# Altium project BMS48Voltsv0.1.PrjPcb
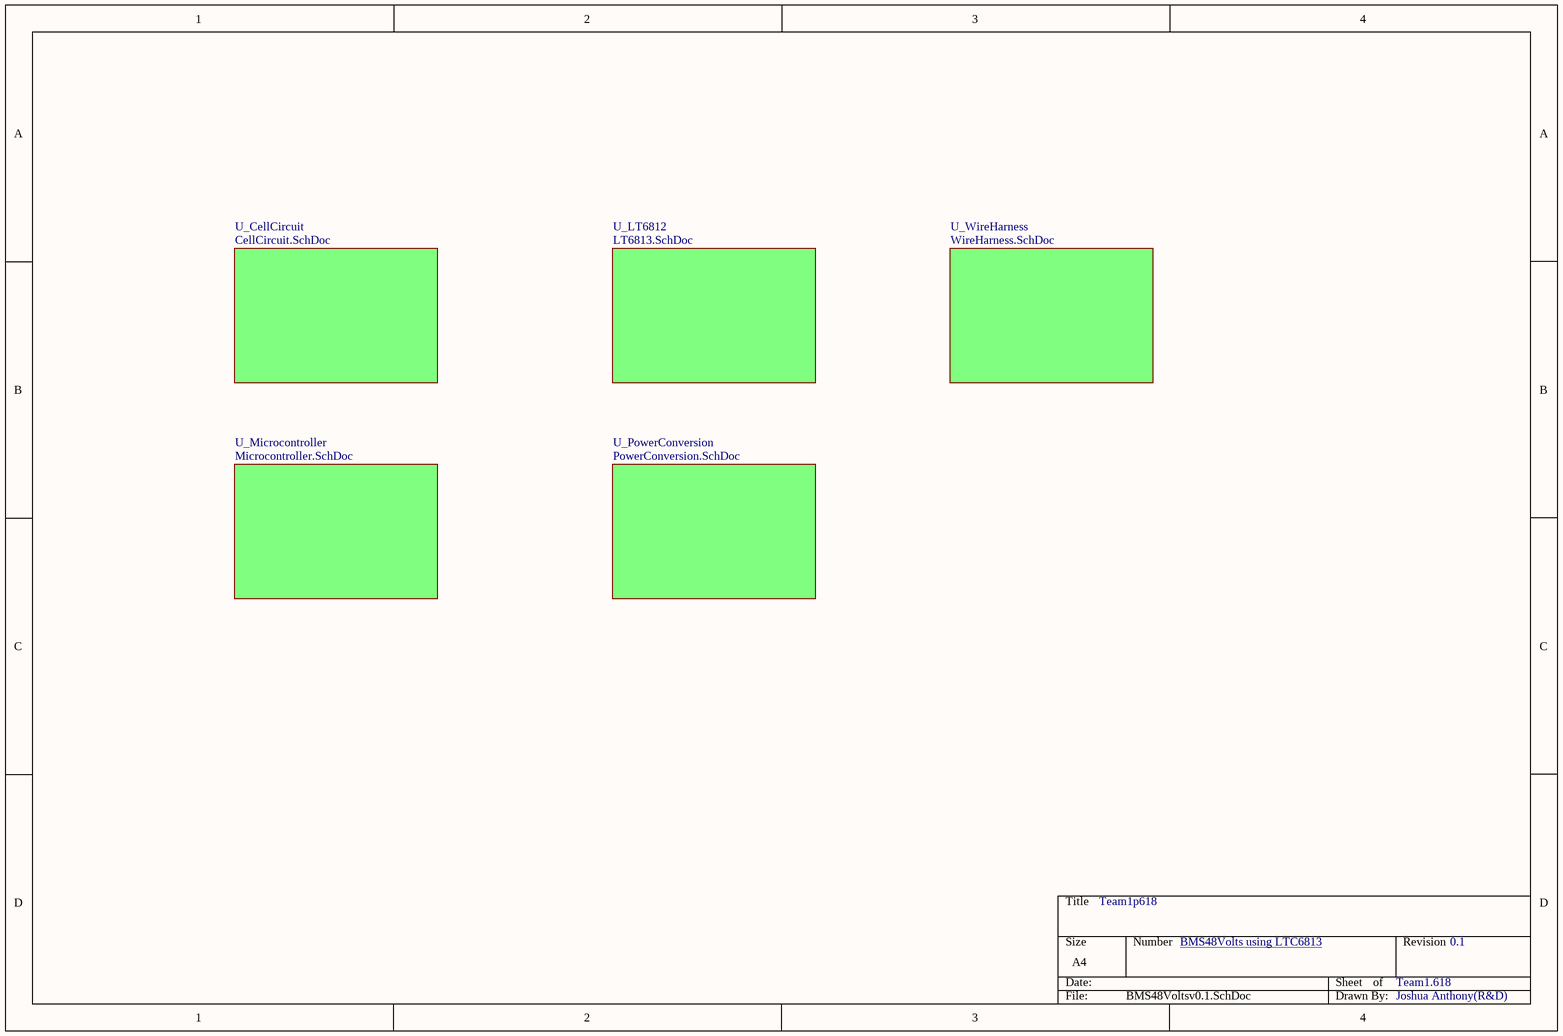
[diagram p0: BMS48Voltsv0.1.SchDoc]
5 sheets, 155 parts. Net scope: flat (ports and power ports of the same name join across sheets).
Board file: BMS48Voltsv0.1.PcbDoc
Sheets:
  BMS48Voltsv0.1.SchDoc
    U_CellCircuit = CellCircuit.SchDoc
    U_LT6812 = LT6813.SchDoc
    U_Microcontroller = Microcontroller.SchDoc
    U_PowerConversion = PowerConversion.SchDoc

## Sheet BMS48Voltsv0.1.SchDoc
size A4; SheetNumber: 1; SheetTotal: 6

### Sub-sheets
U_CellCircuit = CellCircuit.SchDoc: no entries
U_LT6812 = LT6813.SchDoc: no entries
U_Microcontroller = Microcontroller.SchDoc: no entries
U_PowerConversion = PowerConversion.SchDoc: no entries
U_WireHarness = WireHarness.SchDoc (file not in this document): no entries

### Notes on the sheet
- Team1p618
- BMS48Volts using LTC6813 <https://github.com/analogdevicesinc/Linduino/blob/master/LTSketchbook/libraries/LTC6813/LTC6813.cpp>
- Team1.618
- 0.1
- Joshua Anthony(R&D)

## Sheet CellCircuit.SchDoc
size A3; SheetNumber: 3; SheetTotal: 5
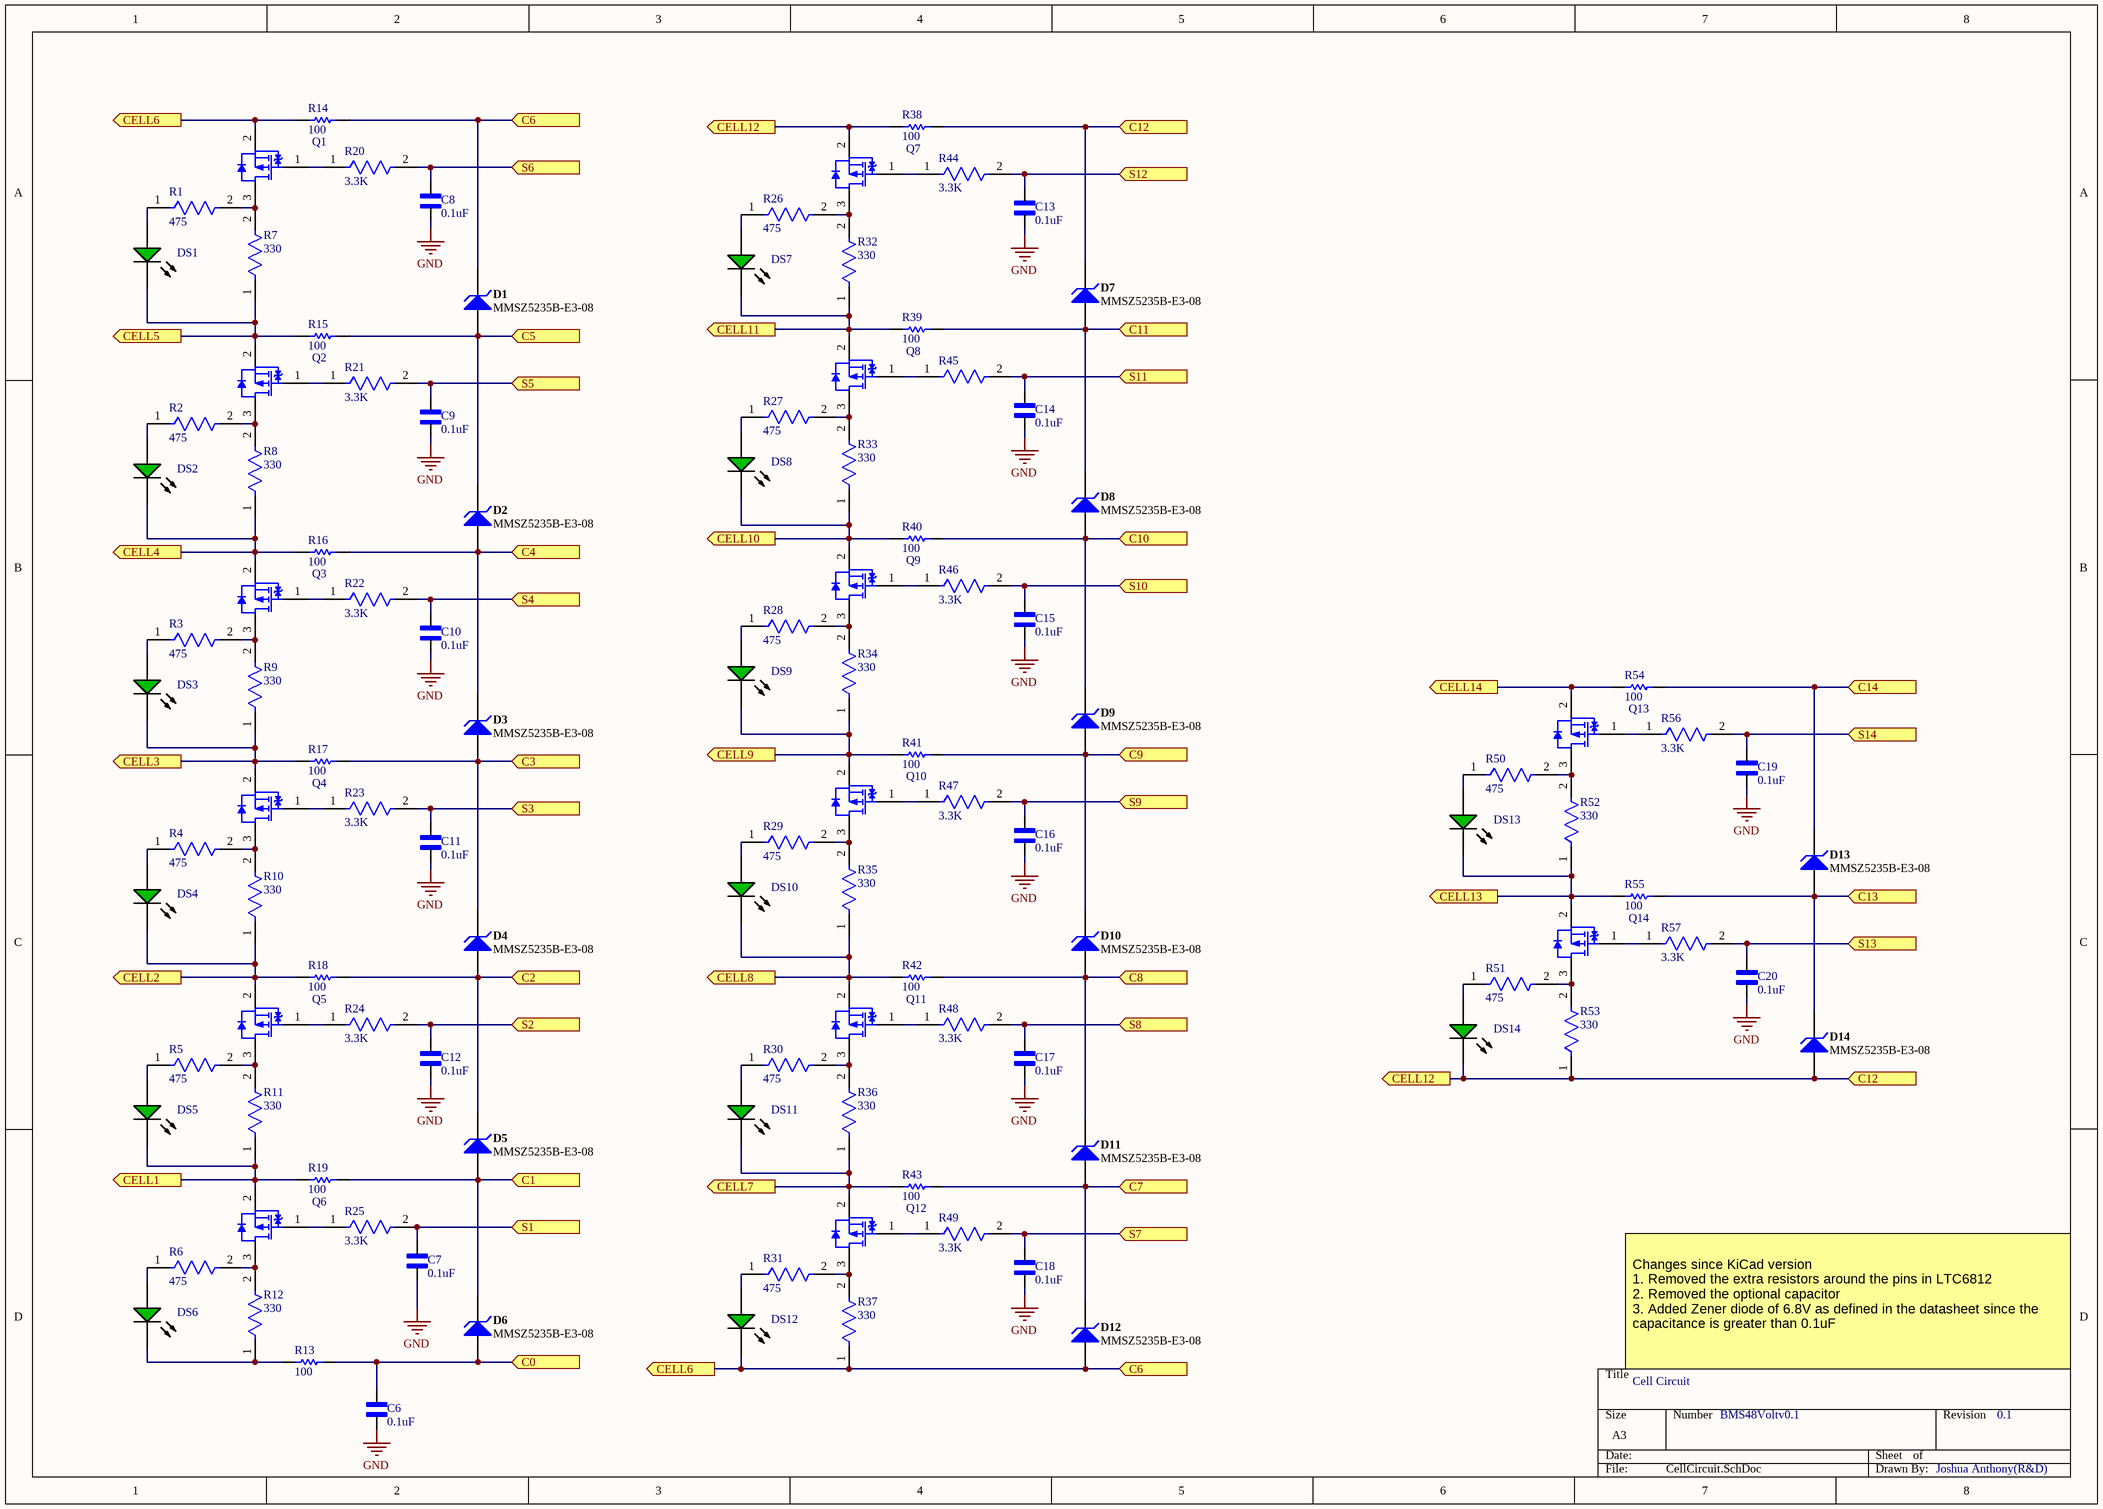
[diagram p1: CellCircuit.SchDoc]

### Parts
C6  0.1uF  [CAPC1005X55N]
C7  0.1uF  [CAPC1005X55N]
C8  0.1uF  [CAPC1005X55N]
C9  0.1uF  [CAPC1005X55N]
C10  0.1uF  [CAPC1005X55N]
C11  0.1uF  [CAPC1005X55N]
C12  0.1uF  [CAPC1005X55N]
C13  0.1uF  [CAPC1005X55N]
C14  0.1uF  [CAPC1005X55N]
C15  0.1uF  [CAPC1005X55N]
C16  0.1uF  [CAPC1005X55N]
C17  0.1uF  [CAPC1005X55N]
C18  0.1uF  [CAPC1005X55N]
C19  0.1uF  [CAPC1005X55N]
C20  0.1uF  [CAPC1005X55N]
D1  MMSZ5235B-E3-08  [VISH-SOD-123-2_V]
D2  MMSZ5235B-E3-08  [VISH-SOD-123-2_V]
D3  MMSZ5235B-E3-08  [VISH-SOD-123-2_V]
D4  MMSZ5235B-E3-08  [VISH-SOD-123-2_V]
D5  MMSZ5235B-E3-08  [VISH-SOD-123-2_V]
D6  MMSZ5235B-E3-08  [VISH-SOD-123-2_V]
D7  MMSZ5235B-E3-08  [VISH-SOD-123-2_V]
D8  MMSZ5235B-E3-08  [VISH-SOD-123-2_V]
D9  MMSZ5235B-E3-08  [VISH-SOD-123-2_V]
D10  MMSZ5235B-E3-08  [VISH-SOD-123-2_V]
D11  MMSZ5235B-E3-08  [VISH-SOD-123-2_V]
D12  MMSZ5235B-E3-08  [VISH-SOD-123-2_V]
D13  MMSZ5235B-E3-08  [VISH-SOD-123-2_V]
D14  MMSZ5235B-E3-08  [VISH-SOD-123-2_V]
DS1  HSMG-C170  [AVAG-HSMX-C170_V]  (value not drawn)
DS2  HSMG-C170  [AVAG-HSMX-C170_V]  (value not drawn)
DS3  HSMG-C170  [AVAG-HSMX-C170_V]  (value not drawn)
DS4  HSMG-C170  [AVAG-HSMX-C170_V]  (value not drawn)
DS5  HSMG-C170  [AVAG-HSMX-C170_V]  (value not drawn)
DS6  HSMG-C170  [AVAG-HSMX-C170_V]  (value not drawn)
DS7  HSMG-C170  [AVAG-HSMX-C170_V]  (value not drawn)
DS8  HSMG-C170  [AVAG-HSMX-C170_V]  (value not drawn)
DS9  HSMG-C170  [AVAG-HSMX-C170_V]  (value not drawn)
DS10  HSMG-C170  [AVAG-HSMX-C170_V]  (value not drawn)
DS11  HSMG-C170  [AVAG-HSMX-C170_V]  (value not drawn)
DS12  HSMG-C170  [AVAG-HSMX-C170_V]  (value not drawn)
DS13  HSMG-C170  [AVAG-HSMX-C170_V]  (value not drawn)
DS14  HSMG-C170  [AVAG-HSMX-C170_V]  (value not drawn)
Q1  BSS308PE  [INF-PG-SOT23_L]  (value not drawn)
Q2  BSS308PE  [INF-PG-SOT23_L]  (value not drawn)
Q3  BSS308PE  [INF-PG-SOT23_L]  (value not drawn)
Q4  BSS308PE  [INF-PG-SOT23_L]  (value not drawn)
Q5  BSS308PE  [INF-PG-SOT23_L]  (value not drawn)
Q6  BSS308PE  [INF-PG-SOT23_L]  (value not drawn)
Q7  BSS308PE  [INF-PG-SOT23_L]  (value not drawn)
Q8  BSS308PE  [INF-PG-SOT23_L]  (value not drawn)
Q9  BSS308PE  [INF-PG-SOT23_L]  (value not drawn)
Q10  BSS308PE  [INF-PG-SOT23_L]  (value not drawn)
Q11  BSS308PE  [INF-PG-SOT23_L]  (value not drawn)
Q12  BSS308PE  [INF-PG-SOT23_L]  (value not drawn)
Q13  BSS308PE  [INF-PG-SOT23_L]  (value not drawn)
Q14  BSS308PE  [INF-PG-SOT23_L]  (value not drawn)
R1  475  [FP-CRCW0402-e3-IPC_C]
R2  475  [FP-CRCW0402-e3-IPC_C]
R3  475  [FP-CRCW0402-e3-IPC_C]
R4  475  [FP-CRCW0402-e3-IPC_C]
R5  475  [FP-CRCW0402-e3-IPC_C]
R6  475  [FP-CRCW0402-e3-IPC_C]
R7  330  [FP-CRCW0603-e3-MFG]
R8  330  [FP-CRCW0603-e3-MFG]
R9  330  [FP-CRCW0603-e3-MFG]
R10  330  [FP-CRCW0603-e3-MFG]
R11  330  [FP-CRCW0603-e3-MFG]
R12  330  [FP-CRCW0603-e3-MFG]
R13  100  [RESC1005X40X25LL05T05]
R14  100  [RESC1005X40X25LL05T05]
R15  100  [RESC1005X40X25LL05T05]
R16  100  [RESC1005X40X25LL05T05]
R17  100  [RESC1005X40X25LL05T05]
R18  100  [RESC1005X40X25LL05T05]
R19  100  [RESC1005X40X25LL05T05]
R20  3.3K  [FP-RMCF2512-IPC_C]
R21  3.3K  [FP-RMCF2512-IPC_C]
R22  3.3K  [FP-RMCF2512-IPC_C]
R23  3.3K  [FP-RMCF2512-IPC_C]
R24  3.3K  [FP-RMCF2512-IPC_C]
R25  3.3K  [FP-RMCF2512-IPC_C]
R26  475  [FP-CRCW0402-e3-IPC_C]
R27  475  [FP-CRCW0402-e3-IPC_C]
R28  475  [FP-CRCW0402-e3-IPC_C]
R29  475  [FP-CRCW0402-e3-IPC_C]
R30  475  [FP-CRCW0402-e3-IPC_C]
R31  475  [FP-CRCW0402-e3-IPC_C]
R32  330  [FP-CRCW0603-e3-MFG]
R33  330  [FP-CRCW0603-e3-MFG]
R34  330  [FP-CRCW0603-e3-MFG]
R35  330  [FP-CRCW0603-e3-MFG]
R36  330  [FP-CRCW0603-e3-MFG]
R37  330  [FP-CRCW0603-e3-MFG]
R38  100  [RESC1005X40X25LL05T05]
R39  100  [RESC1005X40X25LL05T05]
R40  100  [RESC1005X40X25LL05T05]
R41  100  [RESC1005X40X25LL05T05]
R42  100  [RESC1005X40X25LL05T05]
R43  100  [RESC1005X40X25LL05T05]
R44  3.3K  [FP-RMCF2512-IPC_C]
R45  RMCF2512JT3K30  [FP-RMCF2512-IPC_C]  (value not drawn)
R46  3.3K  [FP-RMCF2512-IPC_C]
R47  3.3K  [FP-RMCF2512-IPC_C]
R48  3.3K  [FP-RMCF2512-IPC_C]
R49  3.3K  [FP-RMCF2512-IPC_C]
R50  475  [FP-CRCW0402-e3-IPC_C]
R51  475  [FP-CRCW0402-e3-IPC_C]
R52  330  [FP-CRCW0603-e3-MFG]
R53  330  [FP-CRCW0603-e3-MFG]
R54  100  [RESC1005X40X25LL05T05]
R55  100  [RESC1005X40X25LL05T05]
R56  3.3K  [FP-RMCF2512-IPC_C]
R57  3.3K  [FP-RMCF2512-IPC_C]

### Ports
C0 (in), C1 (in), C2 (in), C3 (in), C4 (in), C5 (in), C6 (in), C7 (in), C8 (in), C9 (in), C10 (in), C11 (in), C12 (in), C13 (in), C14 (in), CELL1 (out), CELL2 (out), CELL3 (out), CELL4 (out), CELL5 (out), CELL6 (out), CELL7 (out), CELL8 (out), CELL9 (out), CELL10 (out), CELL11 (out), CELL12 (out), CELL13 (out), CELL14 (out), S1 (in), S2 (in), S3 (in), S4 (in), S5 (in), S6 (in), S7 (in), S8 (in), S9 (in), S10 (in), S11 (in), S12 (in), S13 (in), S14 (in)

### Nets
GND: C6.1 C7.1 C8.1 C9.1 C10.1 C11.1 C12.1 C13.1 C14.1 C15.1 C16.1 C17.1 C18.1 C19.1 C20.1
NetC6_2: C6.2 D6.1(A) R13.2 ; port C0
NetC7_2: C7.2 R25.2 ; port S1
NetC8_2: C8.2 R20.2 ; port S6
NetC9_2: C9.2 R21.2 ; port S5
NetC10_2: C10.2 R22.2 ; port S4
NetC11_2: C11.2 R23.2 ; port S3
NetC12_2: C12.2 R24.2 ; port S2
NetC13_2: C13.2 R44.2 ; port S12
NetC14_2: C14.2 R45.2 ; port S11
NetC15_2: C15.2 R46.2 ; port S10
NetC16_2: C16.2 R47.2 ; port S9
NetC17_2: C17.2 R48.2 ; port S8
NetC18_2: C18.2 R49.2 ; port S7
NetC19_2: C19.2 R56.2 ; port S14
NetC20_2: C20.2 R57.2 ; port S13
NetD1_1: D1.1(A) D2.2(K) R15.2 ; port C5
NetD1_2: D1.2(K) D12.1(A) DS12.2(K) Q1.2(SOURCE) R14.1 R14.2 R37.1 ; port CELL6, port C6
NetD2_1: D2.1(A) D3.2(K) R16.2 ; port C4
NetD3_1: D3.1(A) D4.2(K) R17.2 ; port C3
NetD4_1: D4.1(A) D5.2(K) R18.2 ; port C2
NetD5_1: D5.1(A) D6.2(K) R19.2 ; port C1
NetD7_1: D7.1(A) D8.2(K) R39.2 ; port C11
NetD7_2: D7.2(K) D14.1(A) DS14.2(K) Q7.2(SOURCE) R38.1 R38.2 R53.1 ; port CELL12, port C12
NetD8_1: D8.1(A) D9.2(K) R40.2 ; port C10
NetD9_1: D9.1(A) D10.2(K) R41.2 ; port C9
NetD10_1: D10.1(A) D11.2(K) R42.2 ; port C8
NetD11_1: D11.1(A) D12.2(K) R43.2 ; port C7
NetD13_1: D13.1(A) D14.2(K) R55.2 ; port C13
NetD13_2: D13.2(K) R54.2 ; port C14
NetDS1_1: DS1.1(A) R1.1
NetDS1_2: DS1.2(K) Q2.2(SOURCE) R7.1 R15.1 ; port CELL5
NetDS2_1: DS2.1(A) R2.1
NetDS2_2: DS2.2(K) Q3.2(SOURCE) R8.1 R16.1 ; port CELL4
NetDS3_1: DS3.1(A) R3.1
NetDS3_2: DS3.2(K) Q4.2(SOURCE) R9.1 R17.1 ; port CELL3
NetDS4_1: DS4.1(A) R4.1
NetDS4_2: DS4.2(K) Q5.2(SOURCE) R10.1 R18.1 ; port CELL2
NetDS5_1: DS5.1(A) R5.1
NetDS5_2: DS5.2(K) Q6.2(SOURCE) R11.1 R19.1 ; port CELL1
NetDS6_1: DS6.1(A) R6.1
NetDS6_2: DS6.2(K) R12.1 R13.1
NetDS7_1: DS7.1(A) R26.1
NetDS7_2: DS7.2(K) Q8.2(SOURCE) R32.1 R39.1 ; port CELL11
NetDS8_1: DS8.1(A) R27.1
NetDS8_2: DS8.2(K) Q9.2(SOURCE) R33.1 R40.1 ; port CELL10
NetDS9_1: DS9.1(A) R28.1
NetDS9_2: DS9.2(K) Q10.2(SOURCE) R34.1 R41.1 ; port CELL9
NetDS10_1: DS10.1(A) R29.1
NetDS10_2: DS10.2(K) Q11.2(SOURCE) R35.1 R42.1 ; port CELL8
NetDS11_1: DS11.1(A) R30.1
NetDS11_2: DS11.2(K) Q12.2(SOURCE) R36.1 R43.1 ; port CELL7
NetDS12_1: DS12.1(A) R31.1
NetDS13_1: DS13.1(A) R50.1
NetDS13_2: DS13.2(K) Q14.2(SOURCE) R52.1 R55.1 ; port CELL13
NetDS14_1: DS14.1(A) R51.1
NetQ1_1: Q1.1(GATE) R20.1
NetQ1_3: Q1.3(DRAIN) R1.2 R7.2
NetQ2_1: Q2.1(GATE) R21.1
NetQ2_3: Q2.3(DRAIN) R2.2 R8.2
NetQ3_1: Q3.1(GATE) R22.1
NetQ3_3: Q3.3(DRAIN) R3.2 R9.2
NetQ4_1: Q4.1(GATE) R23.1
NetQ4_3: Q4.3(DRAIN) R4.2 R10.2
NetQ5_1: Q5.1(GATE) R24.1
NetQ5_3: Q5.3(DRAIN) R5.2 R11.2
NetQ6_1: Q6.1(GATE) R25.1
NetQ6_3: Q6.3(DRAIN) R6.2 R12.2
NetQ7_1: Q7.1(GATE) R44.1
NetQ7_3: Q7.3(DRAIN) R26.2 R32.2
NetQ8_1: Q8.1(GATE) R45.1
NetQ8_3: Q8.3(DRAIN) R27.2 R33.2
NetQ9_1: Q9.1(GATE) R46.1
NetQ9_3: Q9.3(DRAIN) R28.2 R34.2
NetQ10_1: Q10.1(GATE) R47.1
NetQ10_3: Q10.3(DRAIN) R29.2 R35.2
NetQ11_1: Q11.1(GATE) R48.1
NetQ11_3: Q11.3(DRAIN) R30.2 R36.2
NetQ12_1: Q12.1(GATE) R49.1
NetQ12_3: Q12.3(DRAIN) R31.2 R37.2
NetQ13_1: Q13.1(GATE) R56.1
NetQ13_2: Q13.2(SOURCE) R54.1 ; port CELL14
NetQ13_3: Q13.3(DRAIN) R50.2 R52.2
NetQ14_1: Q14.1(GATE) R57.1
NetQ14_3: Q14.3(DRAIN) R51.2 R53.2

### Notes on the sheet
- Changes since KiCad version
  1. Removed the extra resistors around the pins in LTC6812
  2. Removed the optional capacitor
  3. Added Zener diode of 6.8V as defined in the datasheet since the capacitance is greater than 0.1uF
- Cell Circuit
- BMS48Voltv0.1
- 0.1
- Joshua Anthony(R&D)

### Library data of the parts
C6-C20 = GRM155R71C104KA88D: CAP CER 0.1UF 16V 10% X7R 0402; MF: {'manufacturer': u'Murata'}; Package: None; Price: None; Value: *; MP: GRM155R71C104KA88D; Availability: Unavailable
D1-D14 = CMP-0931-00023-1: Small Signal Zener Diode, 6.8 V +/- 5%, -55 to 155 degC, 2-Pin SOD-123, RoHS, Tape and Reel; Manufacturer: Vishay Semiconductor; Zener Impedance (IZT1) (Max.) (Ohm): 5; Test Current (IZT1) (mA): 20; Power Dissipation (mW): 500; Tolerance: +/- 5%; Int. Construction: Single; Zener Voltage (NOM.) (V): 6.8; Mounting Technology: Surface Mount; DatasheetVersion: Rev. 1.9; ComponentLink3Description: Package Specification; ComponentLink3URL: http://www.vishay.com/docs/85774/mmsz5225.pdf; ComponentLink2URL: http://www.vishay.com/docs/85774/mmsz5225.pdf; RoHS: TRUE; Packing: Tape and Reel; ComponentLink2Description: Datasheet; PackageVersion: Rev. 1.9; PackageReference: SOD-123-2; PackageDescription: 2-Pin SMD, Body 2.7 x 1.55 mm, Height 1.35 mm; PartNumber: MMSZ5235B-E3-08; Operating Temperature: -55 to 150 degC; ComponentLink1Description: Manufacturer URL; ComponentLink1URL: http://www.vishay.com/
DS1-DS14 = CMP-2000-05062-1: Chip LED, Green, 2.2 V, -40 to 85 degC, 2-Pin SMD, Pb-Free, Tape and Reel; Manufacturer: Avago; No. of Pins: 2; Peak Wavelength: 570nm; SVHC: NoSVHC(16-Jun-2014); Dominant Wavelength: 572nm; Forward Current If: 20mA; Viewing Angle: 170deg; Lens Shape: Rectangular; PIV Max: 5V; External Width: 1.25mm; LED Type: Standard; External Depth: 0.8mm; Opto Mounting Orientation: Top; Luminous Intensity: 15mcd; Luminous Intensity Min: 4mcd; Forward Voltage VF Max: 2.6V; External Length / Height: 2mm; Bulb Size: 1.25mmx1.4mm; Light Area Height: 1mm; Voltage Vf Typ: 2.2V; Operating Temperature Max: 85degC; Datasheet Version: Oct-08; MSL: MSL2A-4weeks; Peak Forward Current: 20mA; Package Description: 2-Pin Surface Mount Device, Body 2 x 1.25 mm, Height 0.8 mm; Datasheet URL: https://datasheet.ciiva.com/29280/180495-da-01-en-chip-led-hsmg-c170-gelb-gruen-29280971.pdf; Storage Temperature Min: -40degC; LED Colour: Green; Wavelength Typ: 570nm; Mounting Type: SMD; Forward Current If Max: 20mA; Dominant Wavelength Typ: 572nm; LED Mounting: SMD; Operating Temperature Range: -30degCto+85degC; Operating Temperature Min: -30degC; Manufacturer URL: http://www.avagotech.com/; Packaging: CutTape; Luminous Intensity Typ: 15mcd; Package Reference: HSMX-C170; Storage Temperature Max: 85degC; Opto Case Style: SMD; Forward Voltage: 2.2V
Q1-Q14 = CMP-1099-00030-1: P-Channel OptiMOS P3 Small-Signal-Transistor, -30 V VDS, -2 A ID, -55 to 150 degC, PG-SOT23, Reel, Green; Manufacturer: Infineon; RDS (on) (max) (@4.5V): 130Â mOhm; Pto t (max): 0.5Â W; ID (max): -2Â A; IDpuls (max): -8Â A; VDS (max): -30Â V; VGS(th) (min): -2Â V; Green: TRUE; RDS (on) (max): 80Â mOhm; QG: -5Â nC; Rth: 250Â K/W; VGS(th) (max): -1Â V; PartNumber: BSS308PE; ComponentLink3Description: Package Specification; PackageDescription: 3-Pin Small Outline Transistor Package, 2.9 x 1.3 mm Body, 0.95 mm Pitch; Mounting Technology: Surface Mount; Packing: Reel; PackageReference: PG-SOT23; PackageVersion: Apr-08; Halogen-free: TRUE; DatasheetVersion: Rev. 2.03; ComponentLink2URL: http://www.infineon.com/dgdl/BSS308PE_Rev23_.pdf?folderId=db3a304314dca38901154a72e3951a65&fileId=db3a304330f686060131099c80400073; ComponentLink2Description: Datasheet; ComponentLink1Description: Manufacturer URL; ComponentLink1URL: http://www.infineon.com/; ComponentLink3URL: http://www.infineon.com/dgdl/SOT23-Package_Overview.pdf?folderId=db3a30431936bc4b0119532290053c66&fileId=db3a30431936bc4b0119533468123c85
R1-R6 R26-R31 R50 R51 = CMP-2002-00025-2: RES Thick Film, 475Ω, 1%, 0.063W, 100ppm/°C, 0402; Voltage Rating (DC): 50V; Max Power Dissipation: 63mW; Resistance: 75R; Tolerance: 1%; Features: Automotive AEC-Q200; Contact Plating: Tin; Package Quantity: 10; Lead Free: Lead Free; Packaging: Tape and Reel; Termination: SMD/SMT; Case Code (Imperial): 0402; Temperature Coefficient: 100ppm/°C; Depth: 0.5mm; Min Operating Temperature: -55°C; Number of Terminations: 2; Case Code (Metric): 1005; Composition: Thick Film; Max Operating Temperature: 155°C; Radiation Hardening: No; Height: 0.35mm; Military Standard: Not; Width: 0.5mm; Case/Package: 0402; Power Rating: 63mW; Weight: 2.3E-05oz; Length: 1mm; Voltage Rating: 50V
R7-R12 R32-R37 R52 R53 = CMP-1012-00454-3: RES Thick Film, 330Ω, 1%, 0.1W, 100ppm/°C, 0603; Voltage Rating: 75V; Max Power Dissipation: 100mW; Resistance: 330R; Depth: 0.85mm; Contact Plating: Tin; Package Quantity: 10; Termination: SMD/SMT; Tolerance: 1%; Height: 0.45mm; Number of Terminations: 2; Radiation Hardening: No; Features: Automotive AEC-Q200; Case/Package: 0603; Mount: Surface Mount; Case Code (Metric): 1608; Lead Free: Lead Free; Temperature Coefficient: 100ppm/°C; Weight: 7.1E-05oz; Military Standard: Not; Packaging: Tape and Reel; Max Operating Temperature: 155°C; Voltage Rating (DC): 75V; Length: 1.55mm; Min Operating Temperature: -55°C; Composition: Thick Film; Case Code (Imperial): 0603; Width: 0.033inch; Power Rating: 100mW
R13-R19 R38-R43 R54 R55 = CMP-2002-00605-3: Chip Resistor, 100 Ohm, +/- 1%, 100 mW, -55 to 155 degC, 0402 (1005 Metric), RoHS, Tape and Reel; Manufacturer: Basic Passives; PartNumber: ERJ-2RKF1000X; Power Rating: 100 mW; Resistance: 100 Ohm; Voltage Rating: 50 V; Case\/Package: 0402; Width: 0.5 mm; Pins: 2; ComponentLink2Description: Datasheet; PackageReference: 0402; Height: 0.35 mm; Tolerance: 1%; DatasheetVersion: 04/2015; Case Code (Imperial): 0402; Min Operating Temperature: -55 degC; Radiation Hardening: No; Length: 1 mm; Package Quantity: 10000; PackageDescription: 2-Pin Surface Mount Device, Body 1 x 0.5 mm; Mounting Technology: Surface Mount; Case Code (Metric): 1005; Packaging: Tape and Reel; ComponentLink1URL: http://www.panasonic.com/; RoHSCompliant: true; Max Operating Temperature: 155 degC; REACH SVHC: Yes; ComponentLink1Description: Manufacturer URL; ComponentLink2URL: http://industrial.panasonic.com/cdbs/www-data/pdf/RDA0000/AOA0000C86.pdf; Mount: Surface Mount
R20-R25 R44-R49 R56 R57 = CMP-26527-006177-1: 3.3kΩ ±5% 1W 2512 Thick Film Chip Resistor AEC-Q200 compliant; Resistance: 3.3kR; Temperature Coefficient: 200ppm/°C; Height: 0.028inch; Max Operating Temperature: 155°C; Radiation Hardening: No; Case Code (Metric): 6432; Number of Terminations: 2; Case Code (Imperial): 2512; Features: Automotive AEC-Q200; Case/Package: 2512; Width: 0.126inch; Max Power Dissipation: 1W; Packaging: Tape and Reel; Contact Plating: Tin; Tolerance: 5%; Min Operating Temperature: -55°C; Power Rating: 1W; Lead Free: Lead Free; Mount: Surface Mount; Series: RMCF; RoHS Compliant: Yes; Length: 0.248inch; Resistor Type: Thick Film

## Sheet LT6813.SchDoc
size A3; SheetNumber: 5; SheetTotal: 5
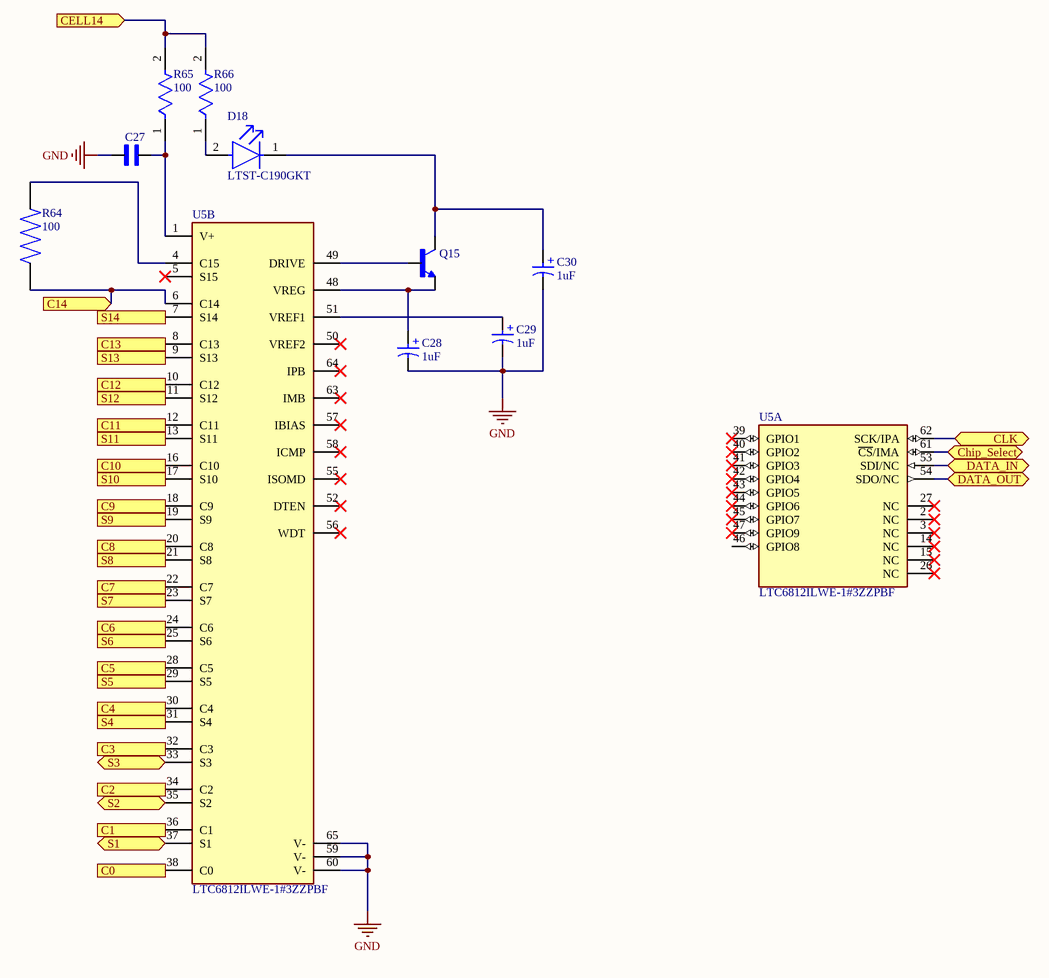
[diagram p2: LT6813.SchDoc]

### Parts
C27  GRM155R71C104KA88D  [CAPC1005X55N]  (value not drawn)
C28  1uF  [WCAP-ASLI_D4H5.5]
C29  1uF  [WCAP-ASLI_D4H5.5]
C30  1uF  [WCAP-ASLI_D4H5.5]
D18  LTST-C190GKT  [FP-LTST-C190GKT-MFG]
Q15  DXT5551P5-13  [TRANS_DXT5551P5-13]  (value not drawn)
R64  100  [RES_ERJ2RKF1000X]
R65  100  [FP-CRCW0402-e3-IPC_C]
R66  100  [FP-CRCW0402-e3-IPC_C]
U5  LTC6812ILWE-1#3ZZPBF  [FP-LWE-64-05-08-1982-MFG]  (parts A,B of 2)

### Ports
C0 (in), C1 (in), C2 (in), C3 (out), C4 (in), C5 (in), C6 (in), C7 (in), C8 (in), C9 (in), C10 (in), C11 (in), C12 (in), C13 (in), C14 (in), CELL14 (in), Chip_Select (bidir), CLK (bidir), DATA_IN (bidir), DATA_OUT (bidir), S1 (bidir), S2 (bidir), S3 (bidir), S4 (in), S5 (in), S6 (in), S7 (in), S8 (in), S9 (in), S10 (in), S11 (in), S12 (in), S13 (in), S14 (in)

### Nets
GND: C27.1 C28.2(N) C29.2(N) C30.2(N) U5.59(V-) U5.60(V-) U5.65(V-)
NetC6_2: U5.38(C0) ; port C0
NetC7_2: U5.37(S1) ; port S1
NetC8_2: U5.25(S6) ; port S6
NetC9_2: U5.29(S5) ; port S5
NetC10_2: U5.31(S4) ; port S4
NetC11_2: U5.33(S3) ; port S3
NetC12_2: U5.35(S2) ; port S2
NetC13_2: U5.11(S12) ; port S12
NetC14_2: U5.13(S11) ; port S11
NetC15_2: U5.17(S10) ; port S10
NetC16_2: U5.19(S9) ; port S9
NetC17_2: U5.21(S8) ; port S8
NetC18_2: U5.23(S7) ; port S7
NetC19_2: U5.7(S14) ; port S14
NetC20_2: U5.9(S13) ; port S13
NetC27_2: C27.2 R65.1 U5.1(V+)
NetC28_1: C28.1(P) Q15.E U5.48(VREG)
NetC29_1: C29.1(P) U5.51(VREF1)
NetC30_1: C30.1(P) D18.1(C) Q15.C
NetD1_1: U5.28(C5) ; port C5
NetD1_2: U5.24(C6) ; port C6
NetD2_1: U5.30(C4) ; port C4
NetD3_1: U5.32(C3) ; port C3
NetD4_1: U5.34(C2) ; port C2
NetD5_1: U5.36(C1) ; port C1
NetD7_1: U5.12(C11) ; port C11
NetD7_2: U5.10(C12) ; port C12
NetD8_1: U5.16(C10) ; port C10
NetD9_1: U5.18(C9) ; port C9
NetD10_1: U5.20(C8) ; port C8
NetD11_1: U5.22(C7) ; port C7
NetD13_1: U5.8(C13) ; port C13
NetD13_2: R64.1 U5.6(C14) ; port C14
NetD18_2: D18.2(A) R66.1
NetQ13_2: R65.2 R66.2 ; port CELL14
NetQ15_B: Q15.B U5.49(DRIVE)
NetR64_2: R64.2 U5.4(C15)
NetU2_16: U5.61(~{CS}/IMA) ; port Chip_Select
NetU2_17: U5.53(SDI/NC) ; port DATA_IN
NetU2_18: U5.54(SDO/NC) ; port DATA_OUT
NetU2_19: U5.62(SCK/IPA) ; port CLK

Not connected (* = marked no-connect by the designer): U5 2(NC)* 3(NC)* 5(S15)* 14(NC)* 15(NC)* 26(NC)* 27(NC)* 39(GPIO1)* 40(GPIO2)* 41(GPIO3)* 42(GPIO4)* 43(GPIO5)* 44(GPIO6)* 45(GPIO7)* 46(GPIO8) 47(GPIO9)* 50(VREF2)* 52(DTEN)* 55(ISOMD)* 56(WDT)* 57(IBIAS)* 58(ICMP)* 63(IMB)* 64(IPB)*

### Notes on the sheet
- (in symbol CMP-03913-130590197-1) +

### Library data of the parts
C27 = GRM155R71C104KA88D: as C6 on sheet CellCircuit; Package: None; Price: None; Value: *; MP: GRM155R71C104KA88D; Availability: Unavailable
C28-C30 = CMP-03913-130590197-1: 865080840001 Cap, 1Uf, 20%, 100V, Alu Elec Smd Rohs Compliant: Yes; Insulation Resistance: 33.3333MΩ; Capacitance: 1µF; Impedance: 20.381Ω; Leakage Current: 3µA; Ripple Current: 7mA; Width: 4.3mm; Min Operating Temperature: -55°C; NexarPartId: 130590197; RoHS: Compliant; Length: 5.5mm; Voltage Rating: 100V; Max Operating Temperature: 105°C; Diameter: 4mm
D18 = CMP-22017-000005-2: LED GREEN CLEAR CHIP SMD; Dominant Wavelength: 569nm; Reverse Voltage: 5V; Lens Color: Colorless; Viewing Angle: 130°; Voltage: 2V; Forward Current: 30mA; Power Dissipation: 100mW; Luminous Intensity: 6mcd; Number of LEDs: 1; Forward Voltage: 2.1V; Wavelength: 565nm; Test Current: 10mA; Min Operating Temperature: -55°C; Lens Style: Clear; Mount: Surface Mount; Width: 0.8mm; Packaging: Tape and Reel; Lens Transparency: Clear; Case Code (Metric): 1608; Depth: 0.8mm; Case Code (Imperial): 0603; Case/Package: 0603; Number of Pins: 2; Max Operating Temperature: 85°C; Lead Free: Lead Free; Number of Elements: 1; Length: 1.6mm; Height: 0.8mm; Package Quantity: 1; Power Rating: 100mW; Radiation Hardening: No; Illumination Color: Green; Color: Green
Q15 = DXT5551P5-13: MF: {'manufacturer': u'Diodes Inc.'}; Package: None; Price: None; Value: *; MP: DXT5551P5-13; Availability: Unavailable
R64 = ERJ2RKF1000X: MF: {'manufacturer': u'Panasonic'}; Package: None; Price: None; Value: *; MP: ERJ2RKF1000X; Availability: Unavailable
R65 R66 = CMP-1011-00397-3: RES Thick Film, 100Ω, 1%, 0.063W, 100ppm/°C, 0402; Max Power Dissipation: 63mW; Voltage Rating: 50V; Resistance: 100R; Package Quantity: 10; Lead Free: Lead Free; Termination: SMD/SMT; Case Code (Metric): 1005; Number of Terminations: 2; Composition: Thick Film; Voltage Rating (DC): 50V; Min Operating Temperature: -55°C; Case/Package: 0402; Radiation Hardening: No; Max Operating Temperature: 155°C; Temperature Coefficient: 100ppm/°C; Military Standard: Not; Length: 1mm; Mount: Surface Mount; Power Rating: 63mW; Weight: 2.3E-05oz; Working Voltage: 50V; Features: Automotive AEC-Q200; Depth: 0.5mm; Packaging: Tape and Reel; Tolerance: 1%; Height: 0.35mm; Case Code (Imperial): 0402; Width: 0.02inch; Contact Plating: Tin
U5 = CMP-09132-000006-1: MULTICELL BAT MON S; Manufacturer: Analog Devices; Nominal Supply Current: 3-6.1uA; Number Of Outputs: 9; Max Junction Temp: +150°C; Min Supply Voltage: 16V; Standoff Height: 0.05mm; Number Of Cells: 15; Automotive Grade: Grade 3; Max Supply Voltage: 75V; Temperature: -40°C to +85°C; Height: 1.6mm; Manufacturer Part Number: LTC6812ILWE-1#3ZZPBF; Category: IC; ComponentLink2Description: Datasheet; Digikey Description: MULTICELL BAT MON S; Device Class L1: Integrated Circuits (ICs); Temperature Range High: +85°C; Octopart: https://octopart.com/ltc6812ilwe-1%233zzpbf-analog+devices-97359568; Temperature Range Low: -40°C; Device Class L2: Power Management ICs; Package: LWE-64-05-08-1982; ComponentLink2URL: https://www.analog.com/media/en/technical-documentation/data-sheets/LTC6812-1.pdf; RoHS: TRUE; Ipc Land Pattern Name: QFP50P1200X1200X160-64; Lead Free: Yes; Automotive: Yes; Device Class L3: Battery Management

## Sheet Microcontroller.SchDoc
size A4; SheetNumber: 2; SheetTotal: 5
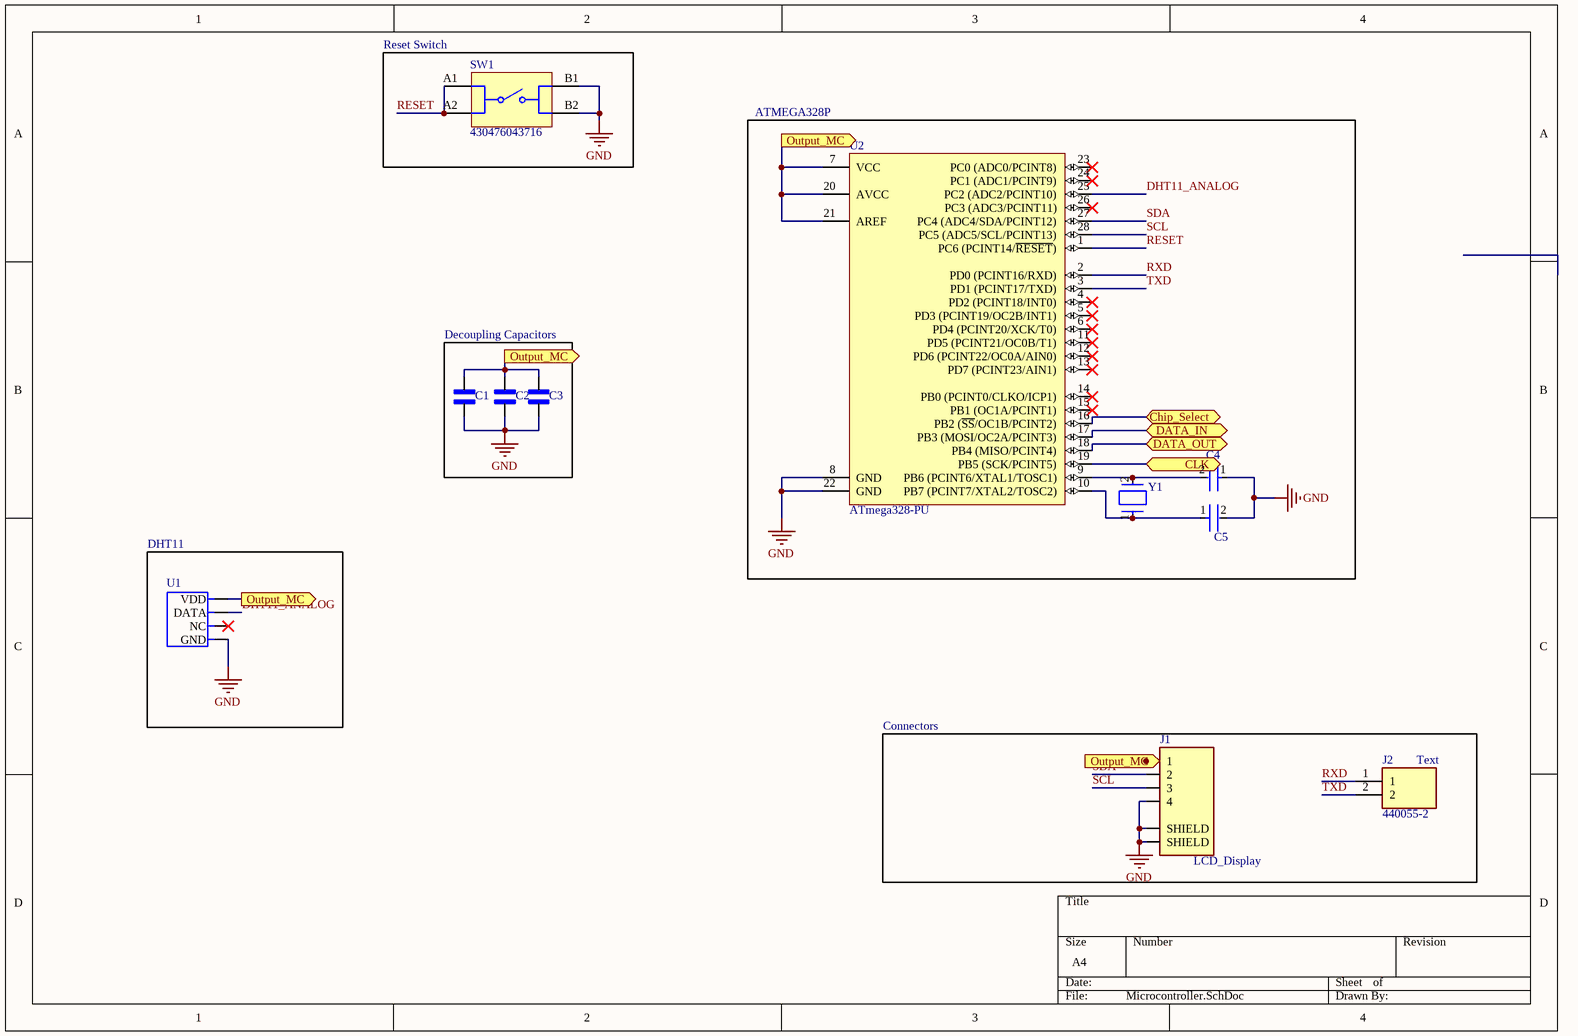
[diagram p3: Microcontroller.SchDoc]

### Parts
C1  GRM033C71C104ME14D  [CAPC0603X33N]  (value not drawn)
C2  GRM033C71C104ME14D  [CAPC0603X33N]  (value not drawn)
C3  GRM033C71C104ME14D  [CAPC0603X33N]  (value not drawn)
C4  C0603X104K5RACTU  [FP-C0603-CJ-MFG]  (value not drawn)
C5  C0603X104K5RACTU  [FP-C0603-CJ-MFG]  (value not drawn)
J1  SM04B-SRSS-TB(LF)(SN)  [JST_SM04B-SRSS-TB(LF)(SN)]  (value not drawn)
J2  440055-2  [TE_440055-2]
SW1  430476043716  [4304x60437x6]
U1  TEM-HUM-DHT11(4P-15.5X12.0MM)  [SNR4-2.54-15.5X12.0X5.5MM]  (value not drawn)
U2  ATmega328-PU  [28P3]
Y1  ABM3-8.000MHZ-D2Y-T  [FP-ABM3-MFG]  (value not drawn)

### Blocks framed on the sheet
Reset Switch: SW1
ATMEGA328P: C4 C5 U2 Y1
Decoupling Capacitors: C1-C3
DHT11: U1

### Ports
Chip_Select (bidir), CLK (bidir), DATA_IN (bidir), DATA_OUT (bidir), Output_MC (out)

### Nets
GND: C1.1 C2.1 C3.1 C4.1 C5.2 J1.4 J1.S1(SHIELD) J1.S2(SHIELD) SW1.B1 SW1.B2 U1.4(GND) U2.8(GND) U2.22(GND)
DHT11_ANALOG: U1.2(DATA) U2.25(PC2_(ADC2/PCINT10))
RESET: SW1.A1 SW1.A2 U2.1(PC6_(PCINT14/~{RESET}))
RXD: J2.1 U2.2(PD0_(PCINT16/RXD))
SCL: J1.3 U2.28(PC5_(ADC5/SCL/PCINT13))
SDA: J1.2 U2.27(PC4_(ADC4/SDA/PCINT12))
TXD: J2.2 U2.3(PD1_(PCINT17/TXD))
NetC1_2: C1.2 C2.2 C3.2 J1.1 U1.1(VDD) U2.7(VCC) U2.20(AVCC) U2.21(AREF) ; port Output_MC
NetC4_2: C4.2 U2.9(PB6_(PCINT6/XTAL1/TOSC1)) Y1.2
NetC5_1: C5.1 U2.10(PB7_(PCINT7/XTAL2/TOSC2)) Y1.1
NetU2_16: U2.16(PB2_(~{SS}/OC1B/PCINT2)) ; port Chip_Select
NetU2_17: U2.17(PB3_(MOSI/OC2A/PCINT3)) ; port DATA_IN
NetU2_18: U2.18(PB4_(MISO/PCINT4)) ; port DATA_OUT
NetU2_19: U2.19(PB5_(SCK/PCINT5)) ; port CLK

Not connected (* = marked no-connect by the designer): U1 3(NC)*; U2 4(PD2_(PCINT18/INT0))* 5(PD3_(PCINT19/OC2B/INT1))* 6(PD4_(PCINT20/XCK/T0))* 11(PD5_(PCINT21/OC0B/T1))* 12(PD6_(PCINT22/OC0A/AIN0))* 13(PD7_(PCINT23/AIN1))* 14(PB0_(PCINT0/CLKO/ICP1))* 15(PB1_(OC1A/PCINT1))* 23(PC0_(ADC0/PCINT8))* 24(PC1_(ADC1/PCINT9))* 26(PC3_(ADC3/PCINT11))*

### Notes on the sheet
- Connectors
- (near J2) Text
- (near J1) LCD_Display

### Library data of the parts
C1-C3 = GRM033C71C104ME14D: Cap Ceramic 0.1uF 16V X7S 20% Pad SMD 0201 125C T/R; MF: {'manufacturer': u'Murata'}; Package: None; Price: None; Value: *; MP: GRM033C71C104ME14D; Availability: Unavailable
C4 C5 = CMP-2006-03300-2: CAP CER 0.1UF 50V X7R 0603; Manufacturer: Kemet; Capacitance: 100nF; Material: Ceramic; Tolerance: 10%; Value: 100nF; Temperature Coefficient: 15%; Temperature Range High: +125°C; Temperature Range Low: -55°C; Manufacturer Part Number: C0603X104K5RACTU; Voltage: 50V; ComponentLink2Description: Datasheet; RoHS: TRUE; ComponentLink2URL: https://content.kemet.com/datasheets/KEM_C1013_X7R_FT-CAP_SMD.pdf; Device Class L3: Ceramic Capacitors; Device Class L2: Capacitors; Package: C0603-CJ; Height: 0.95mm; Device Class L1: Passive Components; Temperature Characteristic: X7R; Lead Free: Yes; Digikey Description: CAP CER 0.1UF 50V X7R 0603; Automotive: No; Mouser Description: Capacitor; Ceramic; Cap 0.1uF; Tol+10%; SMT; Flexible Termination; Vol-Rtg 50V; TR; Temperature: -55°C to +125°C; Octopart: https://octopart.com/c0603x104k5ractu-kemet-9145062; Category: Cap; Voltage Rating: 50V; Ipc Land Pattern Name: CAPC16080X80
J1 = SM04B-SRSS-TB(LF)(SN): SH Series 1.0 mm Pitch 2 Position Single Row Side Entry Shrouded Header; MF: {'manufacturer': u'JST Sales'}; Package: None; Price: None; Value: *; MP: SM04B-SRSS-TB(LF)(SN); Availability: Unavailable
J2 = 440055-2: MF: {'manufacturer': u'TE Connectivity'}; Package: None; Price: None; Value: *; MP: 440055-2; Availability: Unavailable
SW1 = CMP-1456-00007-2: NexarPartId: 31136478; Insulation Resistance: 100MΩ; Actuator Length: 800µm; Illumination Type: Illuminated, Non-Illuminated; Switch Function: Off-Mom; Mechanical Life: 500kcycles; Voltage Rating: 12V; Switch Travel: 300µm; Actuator Material: Liquid Crystal Polymer, Polymer; Current Rating: 50mA; Throw Configuration: SPST; Contact Plating: Silver; RoHS: Compliant; Contact Material: Silver, Stainless Steel; Height: 4.3mm; Mount: Through Hole; Min Operating Temperature: -40°C; Termination: PC Pin; Max Operating Temperature: 85°C; REACH SVHC: No SVHC; Packaging: Bulk; Contact Current Rating: 50mA
U1 = TEM-HUM-DHT11(4P-15.5X12.0MM): 314010000; MF: {'manufacturer': u'UNIVERSAL-SOLDER Electronics Ltd'}; MP: DHT11; Package: None; Price: None; Value: *; Availability: Unavailable
U2 = CMP-0095-00015-2: 8-bit AVR Microcontroller, 32KB Flash, 1KB EEPROM, 2KB SRAM, 28-pin PDIP, Industrial Grade (-40°C to 85°C); ComponentLink3Description: ATmega48A/48PA/88A/88PA/168A/168PA/328/328P Summary; RevisionNote: DatasheetVersion updated. URLs added.; DatasheetVersion: revD, May-2011; ComponentLink1URL: http://www.atmel.com/; PackageVersion: revB, Sep-2001; PackageDescription: 28-lead (0.300"/7.62mm Wide) Plastic Dual Inline Package (PDIP); PackageReference: 28P3; ComponentLink1Description: Manufacturer URL; ComponentLink2Description: ATmega48A/48PA/88A/88PA/168A/168PA/328/328P Datasheet; ComponentLink3URL: http://www.atmel.com/dyn/resources/prod_documents/8271S.pdf; ComponentLink2URL: http://www.atmel.com/dyn/resources/prod_documents/8271.pdf
Y1 = CMP-2000-05033-2: Crystal 8MHz ±20ppm 18pF SMD-2 5mm x 3.2mm; Series Resistance: 500R; Frequency Stability: 30ppm; ESR (Equivalent Series Resistance): 140R; Load Capacitance: 18pF; Height: 0.051inch; Tolerance: 20ppm; Depth: 3.2mm; Max Operating Temperature: 85°C; Frequency: 8MHz; Termination: SMD/SMT; Lead Free: Lead Free; Number of Pins: 2; Width: 3.2mm; RoHS Compliant: Yes; Resistor Type: Ceramic; Length: 5mm; Mount: Surface Mount; Case/Package: CSMD; Package Quantity: 1000; Radiation Hardening: No; Min Operating Temperature: -40°C; Packaging: Tape and Reel; Frequency Tolerance: 20ppm

## Sheet PowerConversion.SchDoc
size A4; SheetNumber: 4; SheetTotal: 5; SPICEModelCacheAJXRZOQB: <root> / <DocumentId>AJXRZOQB</DocumentId> / <CacheFrame Number="0"> / <Model Name="cap" Kind="MDL"> / <Text>*Default semiconductor capacitor / .MODEL CAP C()</Text> / </Model> / </CacheFrame> / </root>
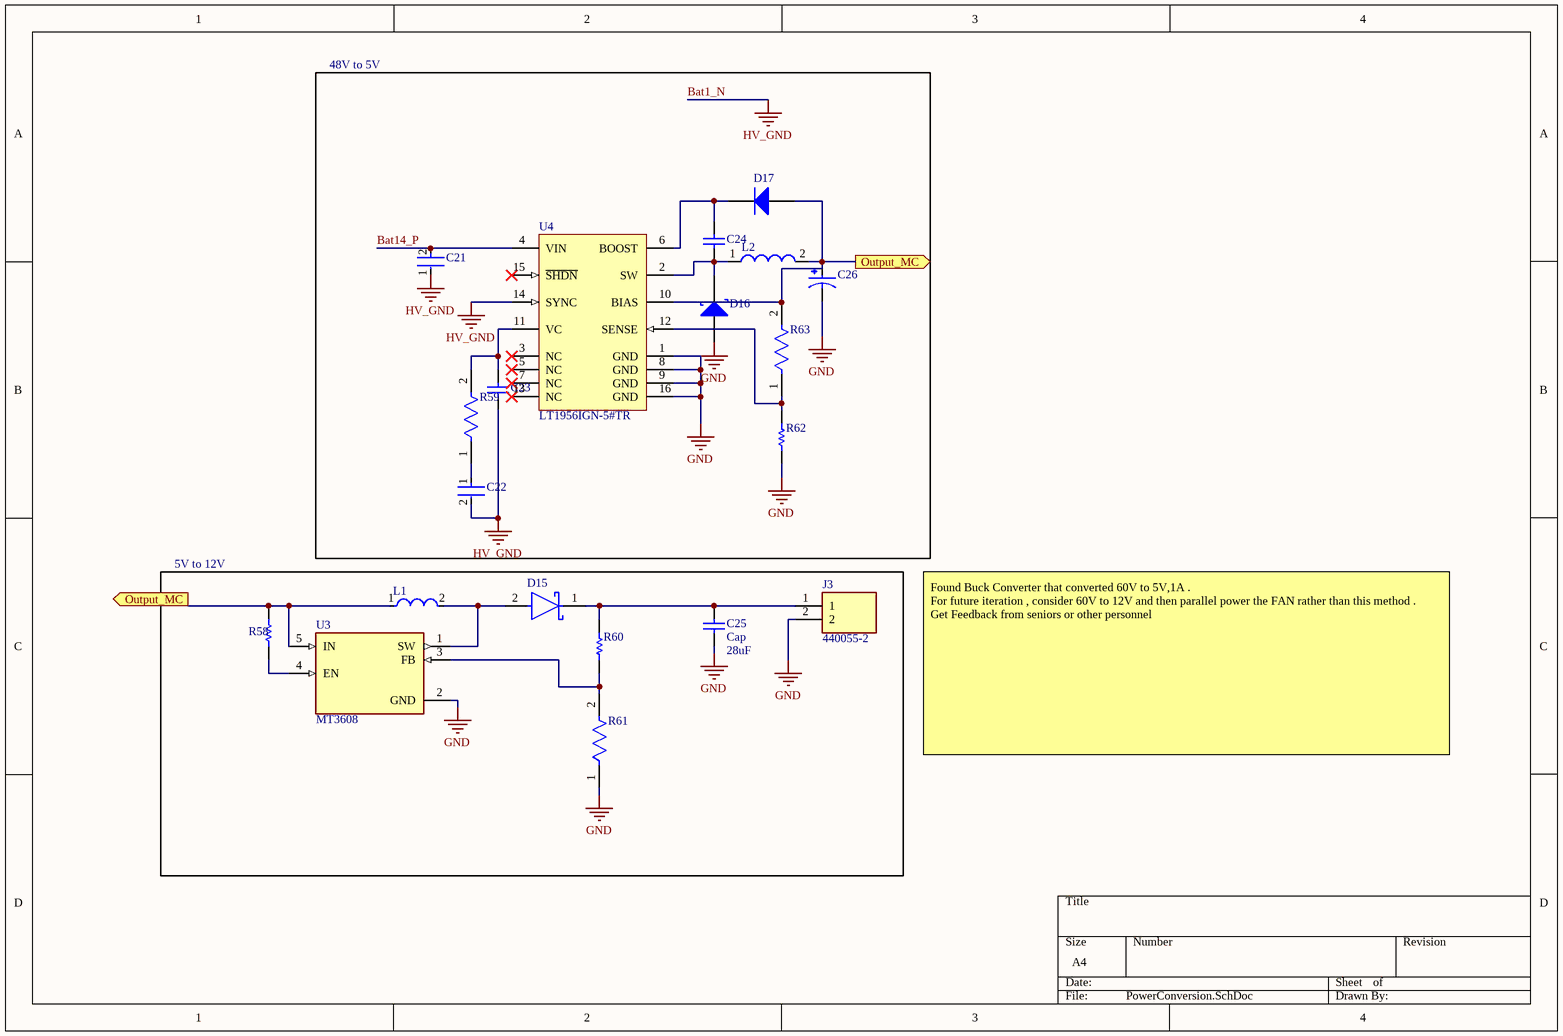
[diagram p4: PowerConversion.SchDoc]

### Parts
C21  18121C225KAZ2A  [FP-1812-L_4_5_0_3-W_3_2_0-IPC_C]  (value not drawn)
C22  CC0603KRX7R9BB223  [FP-CC0603-DA-MFG]  (value not drawn)
C23  C0805C221K5RACTU  [CAPC2013X88X50LL20T25]  (value not drawn)
C24  04025A331JAT2A  [CAPC1005X56X25NL10T15]  (value not drawn)
C25  Cap  value 28uF  [RAD-0.3]
C26  EEE1AA101WR  [CAP_EEE1AA101WR]  (value not drawn)
D15  SS34-E3/57T  [FP-95402-MFG]  (value not drawn)
D16  VS-10MQ060NTRPBF  [VISH-DO-214AC_V]  (value not drawn)
D17  1N4148W-7-F  [DIOD-SOD123-2_V]  (value not drawn)
J3  440055-2  [TE_440055-2]
L1  IHLP2525CZER220M11  [FP-IHLP-2525CZ-FP_2_413x3-MFG]  (value not drawn)
L2  7447471473  [WE-TIS 1111]  (value not drawn)
R58  CRCW040210K0FKEDHP  [RESC1005X40X25ML05T10]  (value not drawn)
R59  AC0402FR-072K2L  [FP-AC0402-IPC_A]  (value not drawn)
R60  CRCW040262K0FKED  [RESC1005X40X25LL05T05]  (value not drawn)
R61  AC0402FR-073K3L  [FP-AC0402-IPC_B]  (value not drawn)
R62  ERA6AEB4991V  [RESC2013X60X40ML20T25]  (value not drawn)
R63  RG2012N-1542-D-T5  [FP-RG2012-IPC_C]  (value not drawn)
U3  MT3608  [SOT95P280X145-6N]
U4  LT1956IGN-5#TR  [LT-GN-16_M]

### Blocks framed on the sheet
48V to 5V: C21-C24 C26 D16 D17 L2 R59 R62 R63 U4
5V to 12V: C25 D15 J3 L1 R58 R60 R61 U3

### Ports
Output_MC (out)

### Nets
Bat1_N: C21.1 C22.2 C23.1 U4.14(SYNC)  [also labelled HV_GND]
GND: C25.1 C26.2 D16.1(A) J3.2 R61.1 R62.1 U3.2(GND) U4.1(GND) U4.8(GND) U4.9(GND) U4.16(GND)
Bat14_P: C21.2 U4.4(VIN)
NetC1_2: C26.1 D17.1(A) L1.1 L2.2 R58.2 R63.2 U3.5(IN) U4.10(BIAS) ; port Output_MC
NetC22_1: C22.1 R59.1
NetC23_2: C23.2 R59.2 U4.11(VC)
NetC24_1: C24.1 D16.2(K) L2.1 U4.2(SW)
NetC24_2: C24.2 D17.2(K) U4.6(BOOST)
NetC25_2: C25.2 D15.1(C) J3.1 R60.2
NetD15_2: D15.2(A) L1.2 U3.1(SW)
NetR58_1: R58.1 U3.4(EN)
NetR60_1: R60.1 R61.2 U3.3(FB)
NetR62_2: R62.2 R63.1 U4.12(SENSE)

Not connected (* = marked no-connect by the designer): U4 3(NC)* 5(NC)* 7(NC)* 13(NC)* 15(~{SHDN})*

### Notes on the sheet
- Found Buck Converter that converted 60V to 5V,1A .
  For future iteration , consider 60V to 12V and then parallel power the FAN rather than this method .
  Get Feedback from seniors or other personnel

### Library data of the parts
C21 = CMP-2000-05505-2: General Purpose Ceramic Capacitor, 1812, 2.2uF, 10%, X7R, 15%, 100V; Dissipation Factor: 2.5%; Case/Package: 1812; Voltage Rating: 100V; Min Operating Temperature: -55°C; RoHS Compliant: Yes; Radiation Hardening: No; Thickness: 0.11inch; Termination: SMD/SMT; Width: 0.126inch; Height: 2.54mm; Mount: Surface Mount; Capacitance: 2.2uF; Tolerance: 10%; Max Operating Temperature: 125°C; Features: Soft Termination; REACH SVHC: No SVHC; Dielectric: X7R; Case Code (Imperial): 1812; Number of Pins: 2; Case Code (Metric): 4532; Packaging: Tape and Reel; Length: 4.5mm; Voltage: 100V; Depth: 3.2mm; Package Quantity: 1; Voltage Rating (DC): 100V; Lead Free: Lead Free
C22 = CMP-2100-03602-3: CAP CER 0.022UF 50V X7R 0603; Dielectric Material: Ceramic; Insulation Resistance: 100GR; Tolerance: 10%; Capacitance: 22nF; Thickness: 0.035inch; Case/Package: 0603; Packaging: Tape and Reel; Voltage Rating (DC): 50V; Length: 1.6mm; Depth: 0.8mm; Dielectric: X7R; Resistor Type: Ceramic; Min Operating Temperature: -55°C; Number of Pins: 2; Series: CC; Mount: Surface Mount; Max Operating Temperature: 125°C; Case Code (Imperial): 0603; Width: 0.031inch; Halogen Free: Halogen Free; Lead Free: Lead Free; Voltage: 50V; RoHS Compliant: Yes; Package Quantity: 1; Height: 0.8mm; REACH SVHC: No SVHC; Voltage Rating: 50V; Case Code (Metric): 1608; Termination: SMD/SMT; Radiation Hardening: No
C23 = CMP-2007-00321-1: Manufacturer: Kemet; Part Number: C0805C221K5RACTU
C24 = CMP-2008-02640-1: Manufacturer: AVX Interconnect / Elco; Part Number: 04025A331JAT2A
C25 = Cap: Capacitor; Published: 8-Jun-2000; LatestRevisionDate: 17-Jul-2002; LatestRevisionNote: Re-released for DXP Platform.; PackageReference: RAD-0.3; Publisher: Altium Limited; PackageDescription: Radial Cap, Thru-Hole; 2 Leads; 0.3 in Pin Spacing
C26 = EEE1AA101WR: MF: {'manufacturer': u'Panasonic'}; Package: None; Price: None; Value: *; MP: EEE1AA101WR; Availability: Unavailable
D15 = CMP-02539-000012-1: DIODE SCHOTTKY 40V 3A DO214AB; Manufacturer: Vishay; Max Junction Temp: +150°C; Peak Reverse Current: 0.5mA; Max Surge Forward Current: 100A; Standoff Height: 0mm; ComponentLink2Description: Datasheet; Device Class L3: Schottky Diodes; Height: 2.62mm; Max Repetitive Reverse Voltage: 40V; Lead Free: Yes; Package: 95402; Temperature Range High: +150°C; ComponentLink2URL: http://www.vishay.com/docs/88751/ss32.pdf; Temperature: -55°C to +150°C; Footprint Url: http://www.vishay.com/docs/95402/smc.pdf; Automotive: No; Forward Current: 3A; Category: Diode; Manufacturer Part Number: SS34-E3/57T; RoHS: TRUE; Device Class L2: Diodes; Mouser Description: Schottky Diodes & Rectifiers 3.0 Amp 40 Volt; Octopart: https://octopart.com/ss34-e3%2F57t-vishay-39552907; Temperature Range Low: -55°C; Device Class L1: Discrete Semiconductors; Digikey Description: DIODE SCHOTTKY 40V 3A DO214AB
D16 = CMP-2000-07404-1: High Performance Schottky Rectifier, 60 V, 1 A, -55 to 150 degC, 2-Pin DO-214AC (SMA), RoHS, Tape and Reel; Manufacturer: Vishay; Current - Reverse Leakage @ Vr: 500µA@60V; Current - Average Rectified (Io): 2.1A; Speed: FastRecovery= / 200mA(Io); Voltage - Forward (Vf) (Max) @ If: 710mV@1.5A; Thermal Resistance: 80°C/WJa; Voltage - DC Reverse (Vr) (Max): 60V; Catalog Drawings: SMASeriesTop / SMASeriesSide; Other Names: 10MQ060NPBFTR / 10MQ060NTRPBF / VS-10MQ060NPBFTR / VS-10MQ060NPBFTR-ND / VS10MQ060NPBFTR-ND / VS10MQ060NTRPBF; Dynamic Catalog: SchottkyDiode; Mounting Type: SurfaceMount; Supplier Device Package: DO-214AC(SMA); Package / Case: DO-214AC,SMA; Mounting Technology: SurfaceMount; Datasheet URL: http://www.vishay.com/docs/94118/vs-10mq060npbf.pdf; Category: DiscreteSemiconductorProducts; Family: Diodes,Rectifiers-Single; Datasheet Version: 02/2015; Package Description: 2-Pin Surface Mount Device, Body 4.245 x 2.665 mm; Quantity Available: Tape&Reel(TR)AlternatePackaging; Junction Operating Temp: -55°C~150°C; Manufacturer URL: http://www.vishay.com/; Diode Type: Schottky; Package Reference: DO-214AC (SMA); Packaging: Tape&Reel(TR); Minimum Quantity: Schottky; Operating Temperature - Junction: -55°C~150°C; Standard Package: 7,500
D17 = CMP-2000-04932-2: Fast Switching Diode, 100 V, 0.15 A, -65 to 150 degC, 2-Pin?SOD123, RoHS, Tape and Reel; Recovery Time: 4ns; Brand: DiodesIncorporated; Unit Weight: 0.000353oz; Max Surge Current: 2A; Peak Reverse Voltage: 100V; Ir - Reverse Current: 1uA; Vf - Forward Voltage: 1.25V; Configuration: Single; If - Forward Current: 0.15A; Product Category: Diodes-GeneralPurpose,Power,Switching; Operating Temperature Range: -65Cto+150C; Packaging: Reel; Manufacturer URL: http://www.diodes.com/; Maximum Operating Temperature: +150C; Height: 1.25mm; Minimum Operating Temperature: -65C; Product: SwitchingDiodes; Package URL: http://www.diodes.com/datasheets/ds18004.pdf; Type: SwitchingDiode; Package Reference: SOD123-2; Width: 1.7mm; Datasheet URL: http://www.farnell.com/datasheets/1915529.pdf; Datasheet Version: Rev. 24-2, 10/2013; Series: 1N4148; Factory Pack Quantity: 3000; Length: 2.85mm; RoHS: True; Manufacturer: DiodesIncorporated; Mounting Style: SMD/SMT; Package / Case: SOD-123
J3 = 440055-2: MF: {'manufacturer': u'TE Connectivity'}; Package: None; Price: None; Value: *; MP: 440055-2; Availability: Unavailable
L1 = CMP-2000-06442-2: Commercial Inductors, Low DCR Series 22uH 2.9A 135mΩ 20%; Self Resonant Frequency: 1MHz; Shielding: Shielded; Core Material: Ferrite; DC Resistance (DCR): 135mR; Test Frequency: 100kHz; Saturation Current: 2.5A; Case/Package: 2525; Inductance Tolerance: 20%; Max DC Current: 2.9A; Inductance: 22uH; Termination: SMD/SMT; Case Code (Imperial): 2525; Mount: Surface Mount; Military Standard: Not; Min Operating Temperature: -55°C; RMS Current (Irms): 2.9A; Package Quantity: 2000; Max Operating Temperature: 125°C; Length: 7.24mm; Depth: 6.72mm; Packaging: Tape and Reel; Height: 3mm; Width: 0.255inch; Lead Free: Lead Free; Tolerance: 20%; Contact Plating: Tin; Current Rating: 2.9A; Number of Pins: 2; Case Code (Metric): 6363; Radiation Hardening: No; Height - Seated (Max): 0.118inch
L2 = CMP-1406-00013-1: Shielded Radial Leaded Wire Wound Inductor WE-TIS, L=47000 µH; Manufacturer: Wuerth Elektronik; Inductance: 47000 ÂµH; ComponentLink2URL: http://www.we-online.de/katalog/media/pdf/7447471473.pdf; ComponentLink2Description: Datasheet; ComponentLink1Description: Manufacturer URL; ComponentLink1URL: http://www.we-online.com; PackageReference: WE-TIS 1111; PartNumber: 7447471473
R58 = CMP-2002-03043-1: Manufacturer: Vishay Dale; Part Number: CRCW040210K0FKEDHP
R59 = CMP-2002-01808-3: RES 2.2kΩ ±1% 0.063W 0402; Temperature Coefficient: 100ppm/°C; Power Rating: 62.5mW; Resistance: 2.2kR; Voltage Rating: 50V; Max Power Dissipation: 63mW; Series: AC; Resistor Type: Thick Film; Case Code (Imperial): 0402; Case Code (Metric): 1005; Features: Moisture Resistant; Termination: SMD/SMT; Height: 0.015inch; Lead Free: Lead Free; Min Operating Temperature: -55°C; RoHS Compliant: Yes; Packaging: Tape and Reel; Tolerance: 1%; Case/Package: 0402; Width: 0.5mm; Length: 0.039inch; Number of Terminations: 2; Weight: 2.3E-05oz; Size Code: 0402; Max Operating Temperature: 155°C
R60 = CMP-2002-00149-1: Manufacturer: Vishay Dale; Part Number: CRCW040262K0FKED
R61 = CMP-2002-01817-3: RES 3.3kΩ ±1% 0.063W 0402; Resistance: 3.3kR; Max Power Dissipation: 63mW; Voltage Rating: 50V; Temperature Coefficient: 100ppm/°C; Power Rating: 62.5mW; Lead Free: Lead Free; Case/Package: 0402; Packaging: Tape and Reel; Min Operating Temperature: -55°C; Tolerance: 1%; RoHS Compliant: Yes; Features: Moisture Resistant; Series: AC; Number of Terminations: 2; Size Code: 0402; Length: 0.039inch; Case Code (Imperial): 0402; Resistor Type: Thick Film; Case Code (Metric): 1005; Termination: SMD/SMT; Width: 0.5mm; Height: 0.015inch; Max Operating Temperature: 155°C
R62 = CMP-2001-00838-1: Manufacturer: Panasonic; Part Number: ERA6AEB4991V
R63 = CMP-28537-000974-1: Automotive Metal Thin Film Chip Resistor, 0805, 15.4kΩ, 0.5%, 10ppm/°C, 0.125W, 150V; Voltage Rating: 100V; Power Rating: 100mW; Resistance: 15.4kR; Max Power Dissipation: 125mW; Case Code (Imperial): 0805; Termination: SMD/SMT; Lead Free: Lead Free; Max Operating Temperature: 155°C; Temperature Coefficient: 10ppm/°C; Features: Automotive AEC-Q200; Case/Package: 0805; Packaging: Tape and Reel; Voltage Rating (DC): 150V; Tolerance: 0.5%; Min Operating Temperature: -55°C; Number of Terminations: 2; Series: RG; Case Code (Metric): 2012; RoHS Compliant: Yes
U3 = MT3608: High Efficiency 1.2MHz 2A Step Up Converter; MF: {'manufacturer': u'Aerosemi Technology Co., Ltd'}; Package: None; Price: None; Value: *; MP: MT3608; Availability: Unavailable
U4 = CMP-0491-00804-1: High Voltage, 1.5 A, 500 kHz Step-Down Switching Regulator, 16-pin SOP (GN-16), -40 to 125 degC, Tape and Reel; Manufacturer: Linear Technology; Frequency Sync Range: 580kHz - 700kHz; Number of Outputs: 1; Packing: Tape and Reel; ComponentLink2URL: http://cds.linear.com/docs/en/datasheet/1956f.pdf; Mounting Technology: Surface Mount; PackageReference: GN-16; PackageDescription: 16-Pin Plastic SSOP, Body 4.9 x 3.9 mm, Pitch 0.635 mm; ComponentLink3Description: Package Specification; RoHS: FALSE; PartNumber: LT1956IGN-5#TR; ComponentLink1Description: Manufacturer URL; ComponentLink1URL: http://www.linear.com/; ComponentLink2Description: Datasheet; PackageVersion: Rev. B, 03/2012; ComponentLink3URL: http://cds.linear.com/docs/en/packaging/05081641_B_GN16.pdf

## Nets that join several sheets
GND: CellCircuit (15 pins), LT6813 (7 pins), Microcontroller (13 pins), PowerConversion (11 pins)
NetC1_2: Microcontroller (8 pins), PowerConversion (8 pins)
NetC6_2: CellCircuit (C6.2 D6.1 R13.2), LT6813 (U5.38)
NetC7_2: CellCircuit (C7.2 R25.2), LT6813 (U5.37)
NetC8_2: CellCircuit (C8.2 R20.2), LT6813 (U5.25)
NetC9_2: CellCircuit (C9.2 R21.2), LT6813 (U5.29)
NetC10_2: CellCircuit (C10.2 R22.2), LT6813 (U5.31)
NetC11_2: CellCircuit (C11.2 R23.2), LT6813 (U5.33)
NetC12_2: CellCircuit (C12.2 R24.2), LT6813 (U5.35)
NetC13_2: CellCircuit (C13.2 R44.2), LT6813 (U5.11)
NetC14_2: CellCircuit (C14.2 R45.2), LT6813 (U5.13)
NetC15_2: CellCircuit (C15.2 R46.2), LT6813 (U5.17)
NetC16_2: CellCircuit (C16.2 R47.2), LT6813 (U5.19)
NetC17_2: CellCircuit (C17.2 R48.2), LT6813 (U5.21)
NetC18_2: CellCircuit (C18.2 R49.2), LT6813 (U5.23)
NetC19_2: CellCircuit (C19.2 R56.2), LT6813 (U5.7)
NetC20_2: CellCircuit (C20.2 R57.2), LT6813 (U5.9)
NetD1_1: CellCircuit (D1.1 D2.2 R15.2), LT6813 (U5.28)
NetD1_2: CellCircuit (7 pins), LT6813 (U5.24)
NetD2_1: CellCircuit (D2.1 D3.2 R16.2), LT6813 (U5.30)
NetD3_1: CellCircuit (D3.1 D4.2 R17.2), LT6813 (U5.32)
NetD4_1: CellCircuit (D4.1 D5.2 R18.2), LT6813 (U5.34)
NetD5_1: CellCircuit (D5.1 D6.2 R19.2), LT6813 (U5.36)
NetD7_1: CellCircuit (D7.1 D8.2 R39.2), LT6813 (U5.12)
NetD7_2: CellCircuit (7 pins), LT6813 (U5.10)
NetD8_1: CellCircuit (D8.1 D9.2 R40.2), LT6813 (U5.16)
NetD9_1: CellCircuit (D9.1 D10.2 R41.2), LT6813 (U5.18)
NetD10_1: CellCircuit (D10.1 D11.2 R42.2), LT6813 (U5.20)
NetD11_1: CellCircuit (D11.1 D12.2 R43.2), LT6813 (U5.22)
NetD13_1: CellCircuit (D13.1 D14.2 R55.2), LT6813 (U5.8)
NetD13_2: CellCircuit (D13.2 R54.2), LT6813 (R64.1 U5.6)
NetQ13_2: CellCircuit (Q13.2 R54.1), LT6813 (R65.2 R66.2)
NetU2_16: LT6813 (U5.61), Microcontroller (U2.16)
NetU2_17: LT6813 (U5.53), Microcontroller (U2.17)
NetU2_18: LT6813 (U5.54), Microcontroller (U2.18)
NetU2_19: LT6813 (U5.62), Microcontroller (U2.19)